# Altium schematic sheet S03.SchDoc: IEEE-1394/Ethernet FPGA Controller
size 381 x 254 mm; Revision: 3.2; SheetNumber: 3; SheetTotal: 10
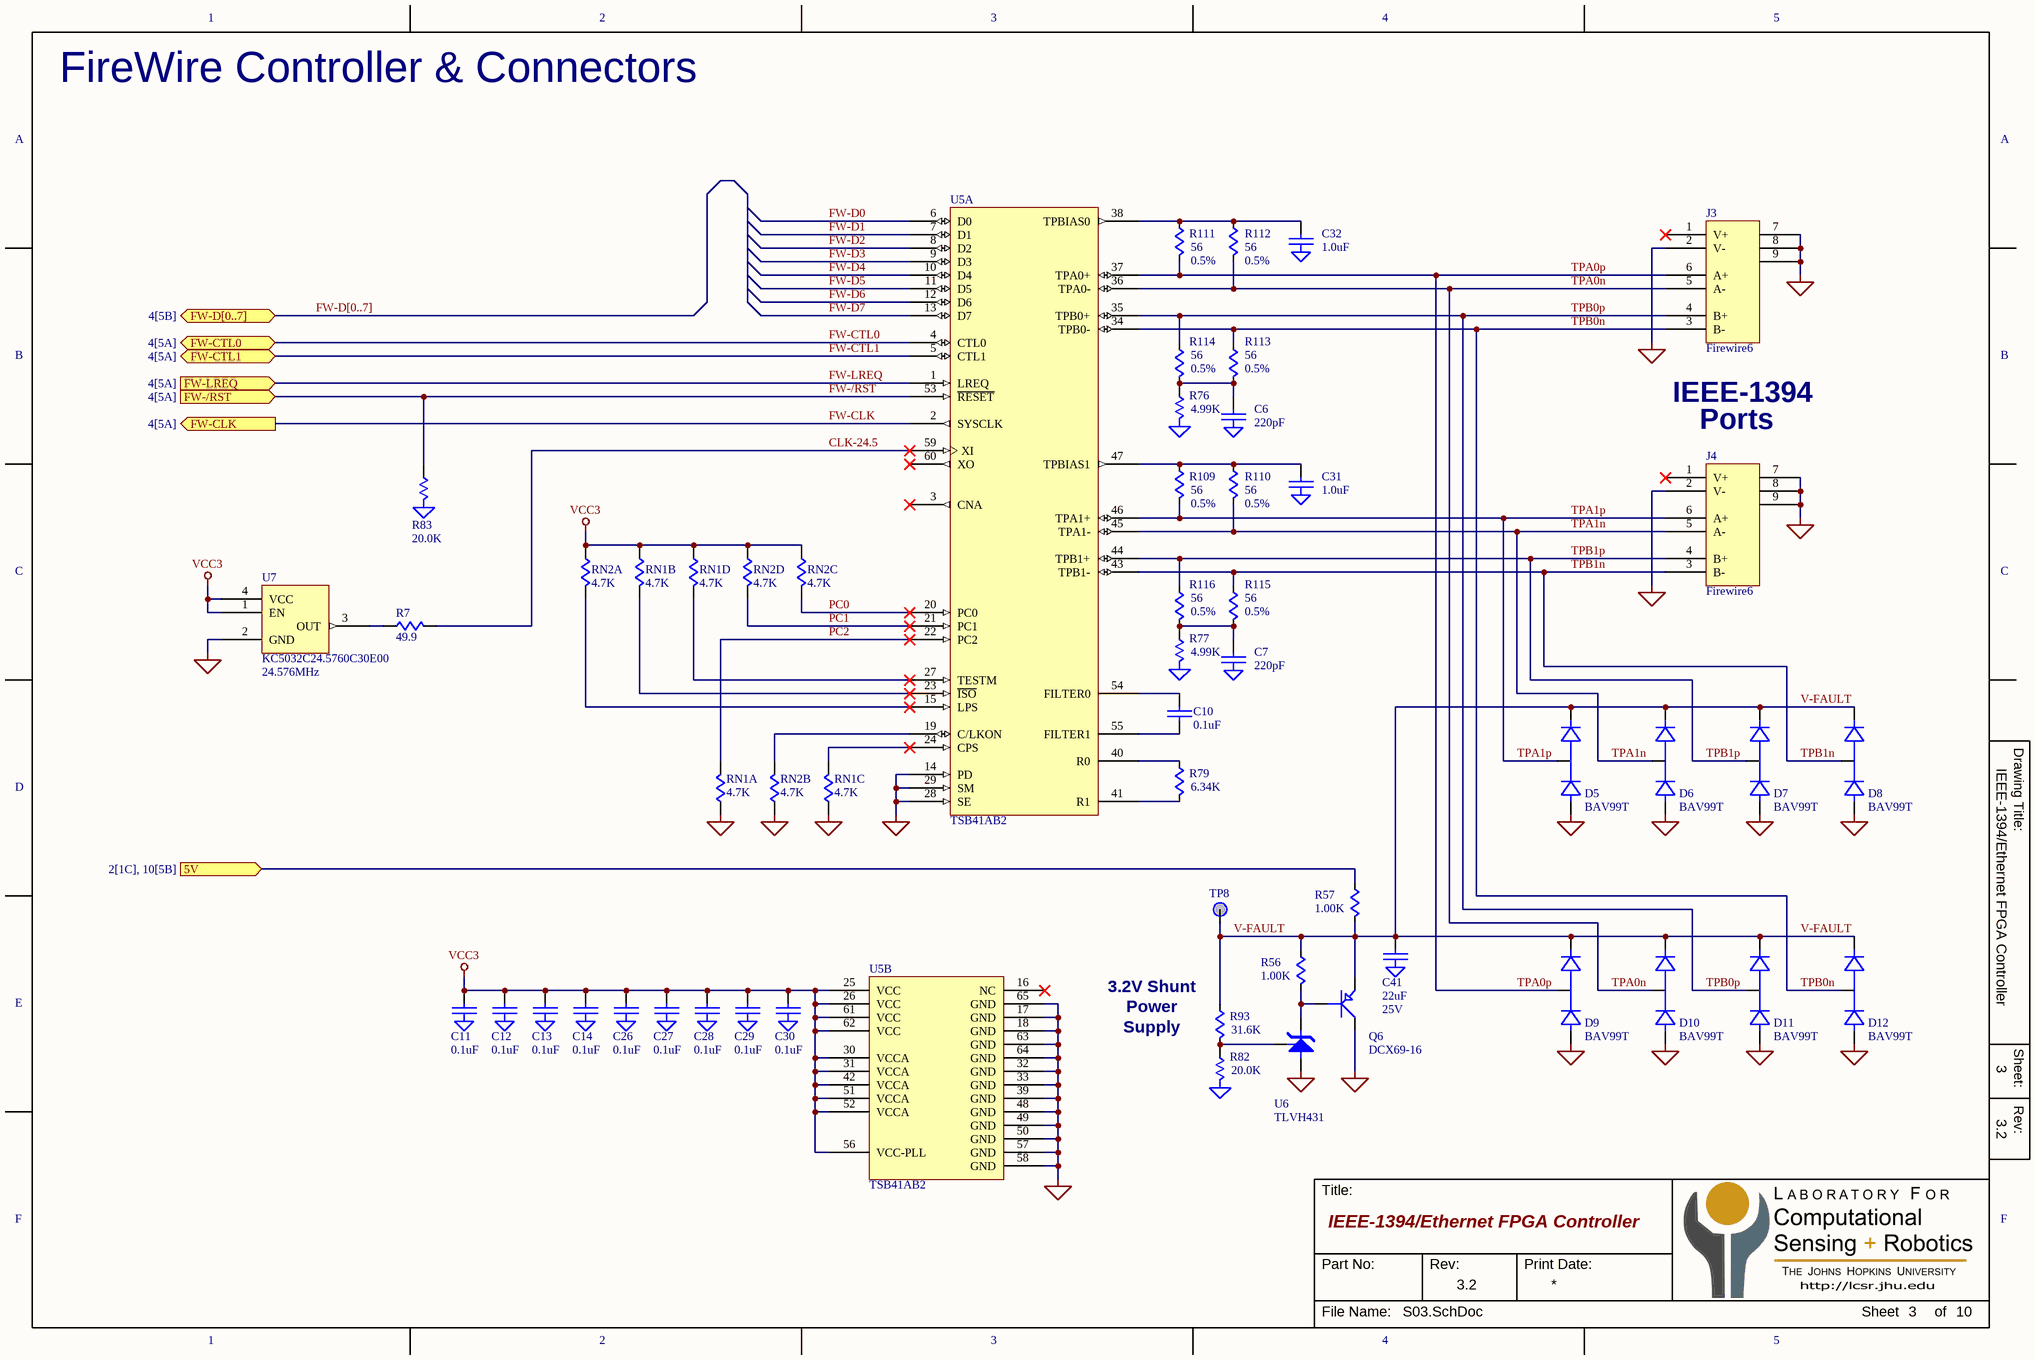
[diagram p0: S03.SchDoc]

## Parts
C6  220pF  [C0603]
C7  220pF  [C0603]
C10  0.1uF  [C0402]
C11  0.1uF  [C0402]
C12  0.1uF  [C0402]
C13  0.1uF  [C0402]
C14  0.1uF  [C0402]
C26  0.1uF  [C0402]
C27  0.1uF  [C0402]
C28  0.1uF  [C0402]
C29  0.1uF  [C0402]
C30  0.1uF  [C0402]
C31  1.0uF  [C0402]
C32  1.0uF  [C0402]
C41  22uF  [C0805]
D5  BAV99T  [SOT-523]
D6  BAV99T  [SOT-523]
D7  BAV99T  [SOT-523]
D8  BAV99T  [SOT-523]
D9  BAV99T  [SOT-523]
D10  BAV99T  [SOT-523]
D11  BAV99T  [SOT-523]
D12  BAV99T  [SOT-523]
J3  Firewire6  [Firewire6-RA]
J4  Firewire6  [Firewire6-RA]
Q6  DCX69-16  [SOT-89]
R7  49.9  [R0201]
R56  1.00K  [R0402]
R57  1.00K  [R0402]
R76  4.99K  [R0402]
R77  4.99K  [R0402]
R79  6.34K  [R0402]
R82  20.0K  [R0402]
R83  20.0K  [R0402]
R93  31.6K  [R0402]
R109  56  Toll: 0.5%  [R0603]
R110  56  Toll: 0.5%  [R0603]
R111  56  Toll: 0.5%  [R0603]
R112  56  Toll: 0.5%  [R0603]
R113  56  Toll: 0.5%  [R0603]
R114  56  Toll: 0.5%  [R0603]
R115  56  Toll: 0.5%  [R0603]
R116  56  Toll: 0.5%  [R0603]
RN1  4.7K  [RN-742C083]  (parts A,B,C,D of 4)
RN2  4.7K  [RN-742C083]  (parts A,B,C,D of 4)
TP8  PAD  [PAD25-SM]  (value not drawn)  (no BOM)
U5  TSB41AB2  [PQFP-65]  (parts A,B of 2)
U6  TLVH431  [SC70-6]
U7  KC5032C24.5760C30E00  Freq: 24.576MHz  [OSC-3x5MM]

## Ports
5V (in, see 2[1C], 10[5B]), FW-/RST (in, see 4[5A]), FW-CLK (out, see 4[5A]), FW-CTL0 (bidir, see 4[5A]), FW-CTL1 (bidir, see 4[5A]), FW-D[0..7] (bidir, see 4[5B]), FW-LREQ (in, see 4[5A])

## Nets
GND: C6.2(GND) C7.2(GND) C11.2(GND) C12.2(GND) C13.2(GND) C14.2(GND) C26.2(GND) C27.2(GND) C28.2(GND) C29.2(GND) C30.2(GND) C31.2(GND) C32.2(GND) C41.2(GND) D5.1(A) D6.1(A) D7.1(A) D8.1(A) D9.1(A) D10.1(A) D11.1(A) D12.1(A) J3.2(V-) J3.7(CHASIS) J3.8(CHASIS) J3.9(CHASIS) J4.2(V-) J4.7(CHASIS) J4.8(CHASIS) J4.9(CHASIS) Q6.3(C) R76.2(GND) R77.2(GND) R82.2(GND) R83.2(GND) RN1.1 RN1.3 RN2.2 U5.14(PD) U5.17(GND) U5.18(GND) U5.28(SE) U5.29(SM) U5.32(GND) U5.33(GND) U5.39(GND) U5.48(GND) U5.49(GND) U5.50(GND) U5.57(GND) U5.58(GND) U5.63(GND) U5.64(GND) U5.65(GND) U6.6(A) U7.2(GND)
VCC3: C11.1 C12.1 C13.1 C14.1 C26.1 C27.1 C28.1 C29.1 C30.1 RN1.2 RN1.4 RN2.1 RN2.3 RN2.4 U5.25(VCC) U5.26(VCC) U5.30(VCCA) U5.31(VCCA) U5.42(VCCA) U5.51(VCCA) U5.52(VCCA) U5.56(VCC-PLL) U5.61(VCC) U5.62(VCC) U7.1(EN) U7.4(VCC)
5V: R57.1 ; port 5V
CLK-24.5: R7.2 U5.59(XI)
FW-/RST: R83.1 U5.53(~{RESET}) ; port FW-/RST
FW-CLK: U5.2(SYSCLK) ; port FW-CLK
FW-CTL0: U5.4(CTL0) ; port FW-CTL0
FW-CTL1: U5.5(CTL1) ; port FW-CTL1
FW-D0: U5.6(D0)
FW-D1: U5.7(D1)
FW-D2: U5.8(D2)
FW-D3: U5.9(D3)
FW-D4: U5.10(D4)
FW-D5: U5.11(D5)
FW-D6: U5.12(D6)
FW-D7: U5.13(D7)
FW-LREQ: U5.1(LREQ) ; port FW-LREQ
PC0: RN2.6 U5.20(PC0)
PC1: RN2.5 U5.21(PC1)
PC2: RN1.8 U5.22(PC2)
TPA0n: D10.3(COM) J3.5(A-) R112.2 U5.36(TPA0-)
TPA0p: D9.3(COM) J3.6(A+) R111.2 U5.37(TPA0+)
TPA1n: D6.3(COM) J4.5(A-) R110.2 U5.45(TPA1-)
TPA1p: D5.3(COM) J4.6(A+) R109.2 U5.46(TPA1+)
TPB0n: D12.3(COM) J3.3(B-) R113.1 U5.34(TPB0-)
TPB0p: D11.3(COM) J3.4(B+) R114.1 U5.35(TPB0+)
TPB1n: D8.3(COM) J4.3(B-) R115.1 U5.43(TPB1-)
TPB1p: D7.3(COM) J4.4(B+) R116.1 U5.44(TPB1+)
V-FAULT: C41.1 D5.2(C) D6.2(C) D7.2(C) D8.2(C) D9.2(C) D10.2(C) D11.2(C) D12.2(C) Q6.2(E) R56.1 R57.2 R93.1 TP8.1
NetC6_1: C6.1 R76.1 R113.2 R114.2
NetC7_1: C7.1 R77.1 R115.2 R116.2
NetC10_1: C10.1 U5.54(FILTER0)
NetC10_2: C10.2 U5.55(FILTER1)
NetC31_1: C31.1 R109.1 R110.1 U5.47(TPBIAS1)
NetC32_1: C32.1 R111.1 R112.1 U5.38(TPBIAS0)
NetQ6_1: Q6.1(B) R56.2 U6.1(C)
NetR7_1: R7.1 U7.3(OUT)
NetR79_1: R79.1 U5.40(R0)
NetR79_2: R79.2 U5.41(R1)
NetR82_1: R82.1 R93.2 U6.3(ADJ)
NetRN1_5: RN1.5 U5.27(TESTM)
NetRN1_6: RN1.6 U5.24(CPS)
NetRN1_7: RN1.7 U5.23(~{ISO})
NetRN2_7: RN2.7 U5.19(C/LKON)
NetRN2_8: RN2.8 U5.15(LPS)

Not connected (* = marked no-connect by the designer): J3 1(V+)*; J4 1(V+)*; U5 3(CNA)* 16(NC)* 60(XO)*

## Buses and harness runs
bus FW-D[0..7] = port FW-D[0..7]

## Notes on the sheet
- FireWire Controller & Connectors
- IEEE-1394
- (near J4) Ports
- (near R93) 3.2V Shunt
- Power
- Supply
- 1
- 2
- 3
- 4
- 5
- A
- B
- C
- Drawing Title:
- D
- E
- Sheet:
- Rev:
- F
- Title:
- Part No:
- Print Date:
- File Name:
- Sheet
- of
- (in symbol CAP-GND) 25V

## Library data of the parts
C6 C7 C11-C14 C26-C32 C41 = CAP-GND
C10 = CAP
D5-D12 = DIODE-2/SER
Q6 = PNP-SM
R7 = R
R56 R57 R79 R93 R109-R116 = R-MINI
R76 R77 R82 R83 = R-GND
RN1 RN2 = RN-DISC-SM-4X
U5 = TSB41AB2: IEEE 1394a-2000 Two-port Transceiver/Arbiter
U6 = TLVH431-SC70
U7 = OSCILATOR